# EAGLE design Bike02 (EAGLE 9.5.2)
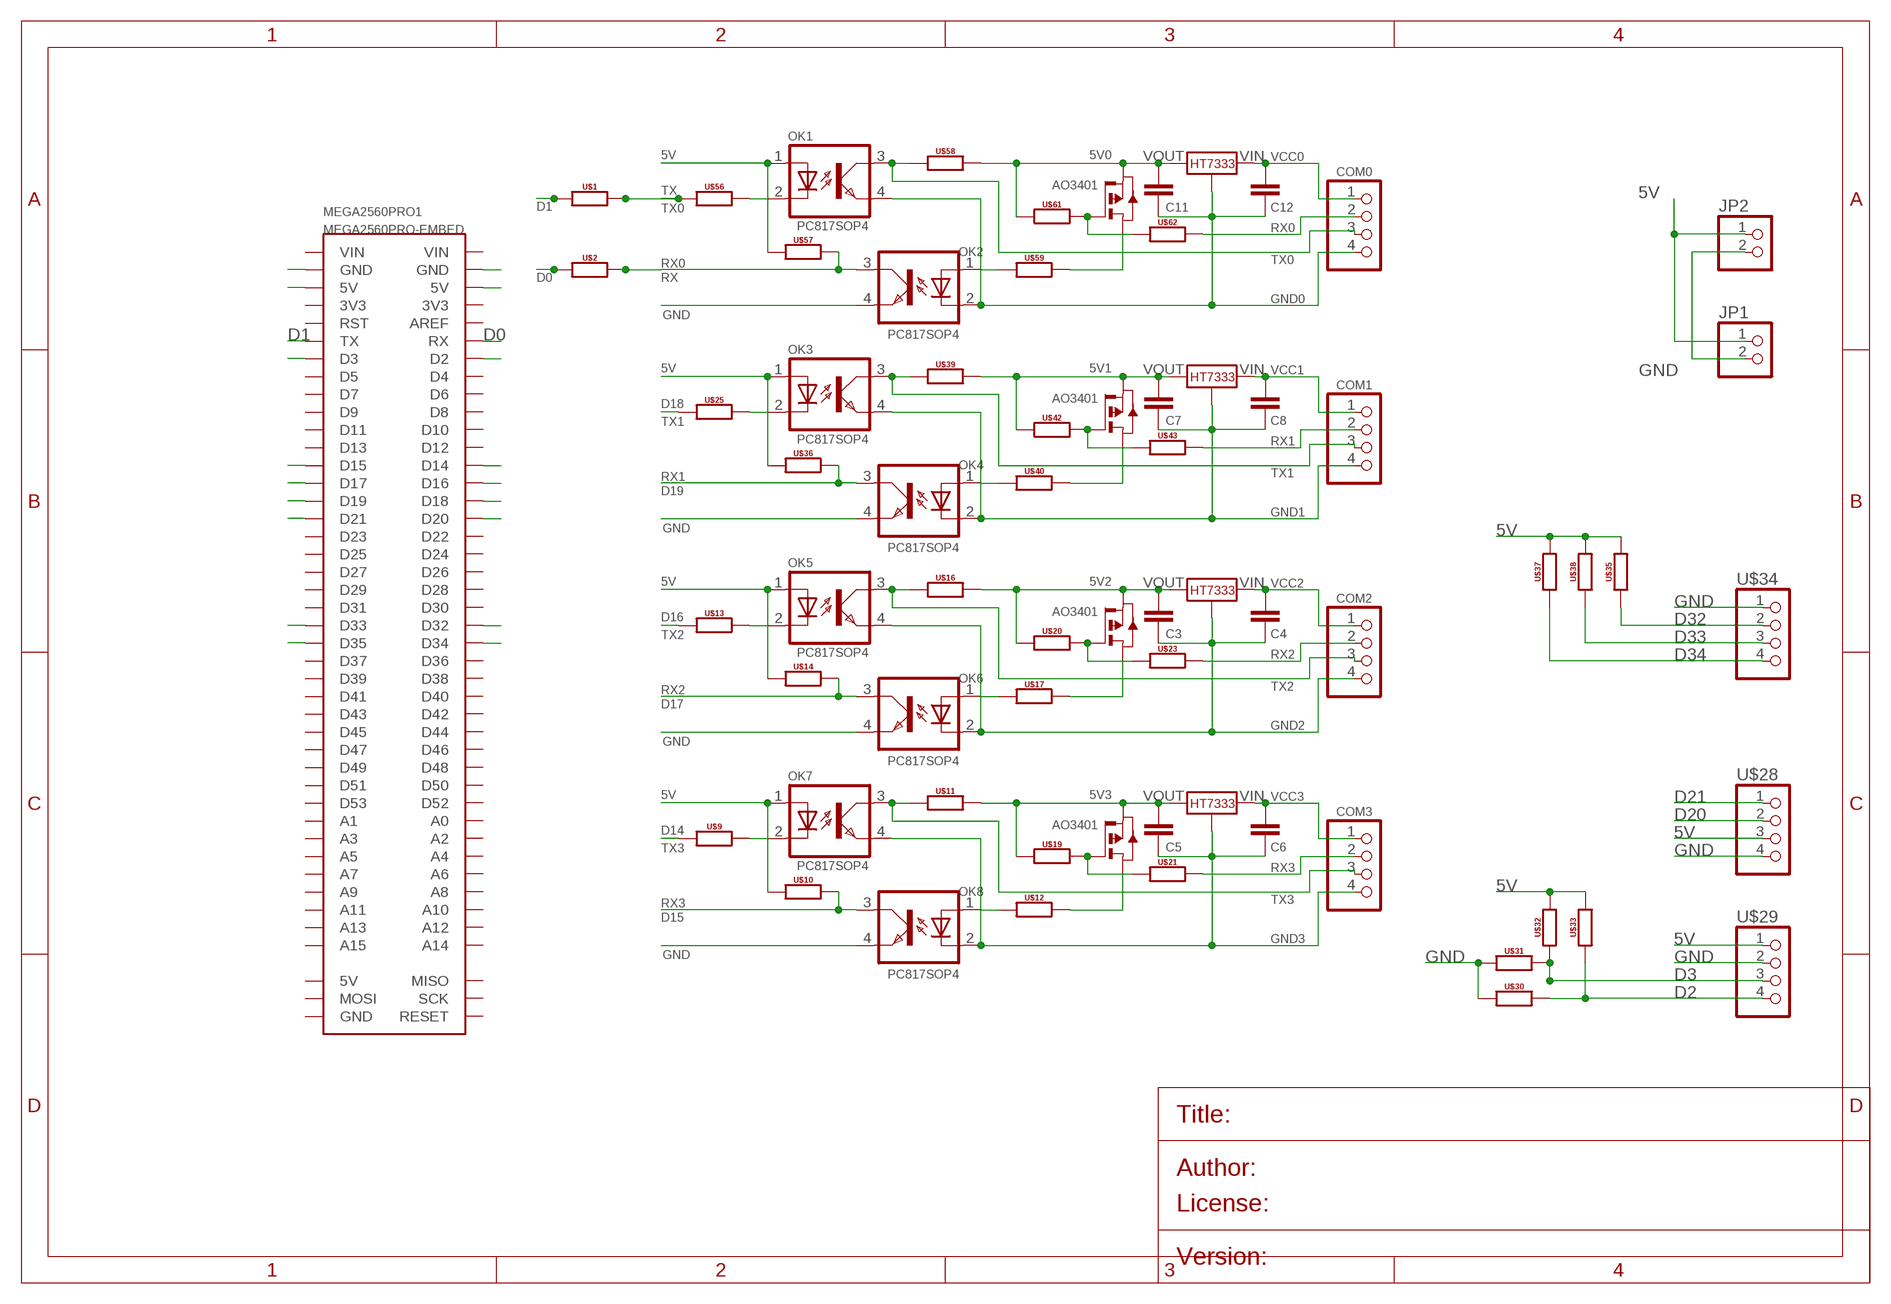
[diagram p0: schematic, sheet 1]

## Parts
C3  CAPACITOR0805  [0805]
C4  CAPACITOR0805  [0805]
C5  CAPACITOR0805  [0805]
C6  CAPACITOR0805  [0805]
C7  CAPACITOR0805  [0805]
C8  CAPACITOR0805  [0805]
C11  CAPACITOR0805  [0805]
C12  CAPACITOR0805  [0805]
COM0  PINHD-1X4_NO_SILK  [1X04_NO_SILK]
COM1  PINHD-1X4_NO_SILK  [1X04_NO_SILK]
COM2  PINHD-1X4_NO_SILK  [1X04_NO_SILK]
COM3  PINHD-1X4_NO_SILK  [1X04_NO_SILK]
JP1  PINHD-1X2-5_NO_SILK  [1X02-5_NO_SILK]
JP2  PINHD-1X2-5_NO_SILK  [1X02-5_NO_SILK]
MEGA2560PRO1  MEGA2560PRO-EMBED  [MEGA2560PRO-EMBED]
OK1  PC817SOP4  [SOP4-2.54]
OK2  PC817SOP4  [SOP4-2.54]
OK3  PC817SOP4  [SOP4-2.54]
OK4  PC817SOP4  [SOP4-2.54]
OK5  PC817SOP4  [SOP4-2.54]
OK6  PC817SOP4  [SOP4-2.54]
OK7  PC817SOP4  [SOP4-2.54]
OK8  PC817SOP4  [SOP4-2.54]
U$1  RESISTOR0805  [0805]
U$2  RESISTOR0805  [0805]
U$9  RESISTOR0805  [0805]
U$10  RESISTOR0805  [0805]
U$11  RESISTOR0805  [0805]
U$12  RESISTOR0805  [0805]
U$13  RESISTOR0805  [0805]
U$14  RESISTOR0805  [0805]
U$15  AO3401  [SOT23]
U$16  RESISTOR0805  [0805]
U$17  RESISTOR0805  [0805]
U$18  AO3401  [SOT23]
U$19  RESISTOR0805  [0805]
U$20  RESISTOR0805  [0805]
U$21  RESISTOR0805  [0805]
U$22  HT7333  [SOT89]
U$23  RESISTOR0805  [0805]
U$24  HT7333  [SOT89]
U$25  RESISTOR0805  [0805]
U$28  PINHD-1X4_NO_SILK  [1X04_NO_SILK]
U$29  PINHD-1X4_NO_SILK  [1X04_NO_SILK]
U$30  RESISTOR0805  [0805]
U$31  RESISTOR0805  [0805]
U$32  RESISTOR0805  [0805]
U$33  RESISTOR0805  [0805]
U$34  PINHD-1X4_NO_SILK  [1X04_NO_SILK]
U$35  RESISTOR0805  [0805]
U$36  RESISTOR0805  [0805]
U$37  RESISTOR0805  [0805]
U$38  RESISTOR0805  [0805]
U$39  RESISTOR0805  [0805]
U$40  RESISTOR0805  [0805]
U$41  AO3401  [SOT23]
U$42  RESISTOR0805  [0805]
U$43  RESISTOR0805  [0805]
U$44  HT7333  [SOT89]
U$56  RESISTOR0805  [0805]
U$57  RESISTOR0805  [0805]
U$58  RESISTOR0805  [0805]
U$59  RESISTOR0805  [0805]
U$60  AO3401  [SOT23]
U$61  RESISTOR0805  [0805]
U$62  RESISTOR0805  [0805]
U$63  HT7333  [SOT89]

## Nets
5V [PWR]: JP1.1 JP2.1 MEGA2560PRO1.5V@1(5V) MEGA2560PRO1.5V@2(5V) OK1.1(A) OK3.1(A) OK5.1(A) OK7.1(A) U$10.1 U$14.1 U$28.3 U$29.1 U$32.2 U$33.2 U$35.2 U$36.1 U$37.2 U$38.2 U$57.1
5V0 [PWR]: C11.1 U$58.2 U$60.2(S) U$61.1 U$63.VOUT
5V1 [PWR]: C7.1 U$39.2 U$41.2(S) U$42.1 U$44.VOUT
5V2 [PWR]: C3.1 U$16.2 U$18.2(S) U$20.1 U$24.VOUT
5V3 [PWR]: C5.1 U$11.2 U$15.2(S) U$19.1 U$22.VOUT
D0: MEGA2560PRO1.RX U$2.1
D1: MEGA2560PRO1.TX U$1.1
D2: MEGA2560PRO1.D2 U$29.4 U$30.2 U$33.1
D3: MEGA2560PRO1.D3 U$29.3 U$31.2 U$32.1
D14: MEGA2560PRO1.D14 U$9.1
D15: MEGA2560PRO1.D15 OK8.3(COL) U$10.2
D16: MEGA2560PRO1.D16 U$13.1
D17: MEGA2560PRO1.D17 OK6.3(COL) U$14.2
D18: MEGA2560PRO1.D18 U$25.1
D19: MEGA2560PRO1.D19 OK4.3(COL) U$36.2
D20: MEGA2560PRO1.D20 U$28.2
D21: MEGA2560PRO1.D21 U$28.1
D32: MEGA2560PRO1.D32 U$34.2 U$35.1
D33: MEGA2560PRO1.D33 U$34.3 U$38.1
D34: MEGA2560PRO1.D34 U$34.4 U$37.1
D35: MEGA2560PRO1.D35
GND [PWR]: JP1.2 JP2.2 MEGA2560PRO1.GND@1(GND) MEGA2560PRO1.GND@2(GND) OK2.4(EMIT) OK4.4(EMIT) OK6.4(EMIT) OK8.4(EMIT) U$28.4 U$29.2 U$30.1 U$31.1 U$34.1
GND0 [PWR]: C11.2 C12.2 COM0.4 OK1.4(EMIT) OK2.2(C) U$63.GND
GND1 [PWR]: C7.2 C8.2 COM1.4 OK3.4(EMIT) OK4.2(C) U$44.GND
GND2 [PWR]: C3.2 C4.2 COM2.4 OK5.4(EMIT) OK6.2(C) U$24.GND
GND3 [PWR]: C5.2 C6.2 COM3.4 OK7.4(EMIT) OK8.2(C) U$22.GND
N$5: OK7.2(C) U$9.2
N$6: OK5.2(C) U$13.2
N$7: OK6.1(A) U$17.1
N$8: OK8.1(A) U$12.1
N$9: U$12.2 U$15.3(D)
N$10: U$17.2 U$18.3(D)
N$11: U$18.1(G) U$20.2 U$23.1
N$12: U$15.1(G) U$19.2 U$21.1
N$13: OK3.2(C) U$25.2
N$14: OK4.1(A) U$40.1
N$15: U$40.2 U$41.3(D)
N$16: U$41.1(G) U$42.2 U$43.1
N$21: OK1.2(C) U$56.2
N$22: OK2.1(A) U$59.1
N$23: U$59.2 U$60.3(D)
N$24: U$60.1(G) U$61.2 U$62.1
RX: OK2.3(COL) U$2.2 U$57.2
RX0: COM0.2 U$62.2
RX1: COM1.2 U$43.2
RX2: COM2.2 U$23.2
RX3: COM3.2 U$21.2
TX: U$1.2 U$56.1
TX0: COM0.3 OK1.3(COL) U$58.1
TX1: COM1.3 OK3.3(COL) U$39.1
TX2: COM2.3 OK5.3(COL) U$16.1
TX3: COM3.3 OK7.3(COL) U$11.1
VCC0 [PWR]: C12.1 COM0.1 U$63.VIN
VCC1 [PWR]: C8.1 COM1.1 U$44.VIN
VCC2 [PWR]: C4.1 COM2.1 U$24.VIN
VCC3 [PWR]: C6.1 COM3.1 U$22.VIN
Unconnected: MEGA2560PRO1.3V3@1(3V3) MEGA2560PRO1.3V3@2(3V3) MEGA2560PRO1.5V@3(5V) MEGA2560PRO1.A0 MEGA2560PRO1.A1 MEGA2560PRO1.A2 MEGA2560PRO1.A3 MEGA2560PRO1.A4 MEGA2560PRO1.A5 MEGA2560PRO1.A6 MEGA2560PRO1.A7 MEGA2560PRO1.A8 MEGA2560PRO1.A9 MEGA2560PRO1.A10 MEGA2560PRO1.A11 MEGA2560PRO1.A12 MEGA2560PRO1.A13 MEGA2560PRO1.A14 MEGA2560PRO1.A15 MEGA2560PRO1.AREF MEGA2560PRO1.D4 MEGA2560PRO1.D5 MEGA2560PRO1.D6 MEGA2560PRO1.D7 MEGA2560PRO1.D8 MEGA2560PRO1.D9 MEGA2560PRO1.D10 MEGA2560PRO1.D11 MEGA2560PRO1.D12 MEGA2560PRO1.D13 MEGA2560PRO1.D22 MEGA2560PRO1.D23 MEGA2560PRO1.D24 MEGA2560PRO1.D25 MEGA2560PRO1.D26 MEGA2560PRO1.D27 MEGA2560PRO1.D28 MEGA2560PRO1.D29 MEGA2560PRO1.D30 MEGA2560PRO1.D31 MEGA2560PRO1.D36 MEGA2560PRO1.D37 MEGA2560PRO1.D38 MEGA2560PRO1.D39 MEGA2560PRO1.D40 MEGA2560PRO1.D41 MEGA2560PRO1.D42 MEGA2560PRO1.D43 MEGA2560PRO1.D44 MEGA2560PRO1.D45 MEGA2560PRO1.D46 MEGA2560PRO1.D47 MEGA2560PRO1.D48 MEGA2560PRO1.D49 MEGA2560PRO1.D50 MEGA2560PRO1.D51 MEGA2560PRO1.D52 MEGA2560PRO1.D53 MEGA2560PRO1.GND@3(GND) MEGA2560PRO1.MISO MEGA2560PRO1.MOSI MEGA2560PRO1.RESET MEGA2560PRO1.RST MEGA2560PRO1.SCK MEGA2560PRO1.VIN@1(VIN) MEGA2560PRO1.VIN@2(VIN)

## Notes on the sheet
- TX0
- RX0
- TX1
- RX1
- TX2
- RX2
- TX3
- RX3

## Library data of the parts
C3-C8 C11 C12 = flash_pow3:CAPACITOR: CAPACITOR, European symbol
COM0 COM1-COM3 U$28 U$29 U$34 = flash_pow3:PINHD-1X4
JP1 JP2 = flash_pow3:PINHD-1X2: PIN HEADER
MEGA2560PRO1 = flash_pow3:MEGA2560PRO-EMBED: Robotdyn Robotdyn Mega 2560 PRO (Embed) https://robotdyn.com/mega-2560-pro-embed-ch340g-atmega2560-16au.html
OK1-OK8 = flash_pow3:PC817: SHARP OPTO COUPLER
U$1 U$2 U$9-U$14 U$16 U$17 U$19-U$21 U$23 U$25 U$30-U$33 U$35-U$40 U$42 U$43 U$56-U$59 U$61 U$62 = flash_pow3:RESISTOR: Generic EU resistor symbol
U$15 U$18 U$41 U$60 = flash_pow3:AO3401; AVAILABILITY: Unavailable; DESCRIPTION: P-Channel 30V 4A _Ta_ 1.4W _Ta_ Surface Mount SOT-23-3; MF: Alpha & Omega Semiconductor; MP: AO3401; PACKAGE: None; PRICE: None
U$22 U$24 U$44 U$63 = flash_pow3:HT7333

## Net classes
1 PWR: width 0.3 mm

## Board
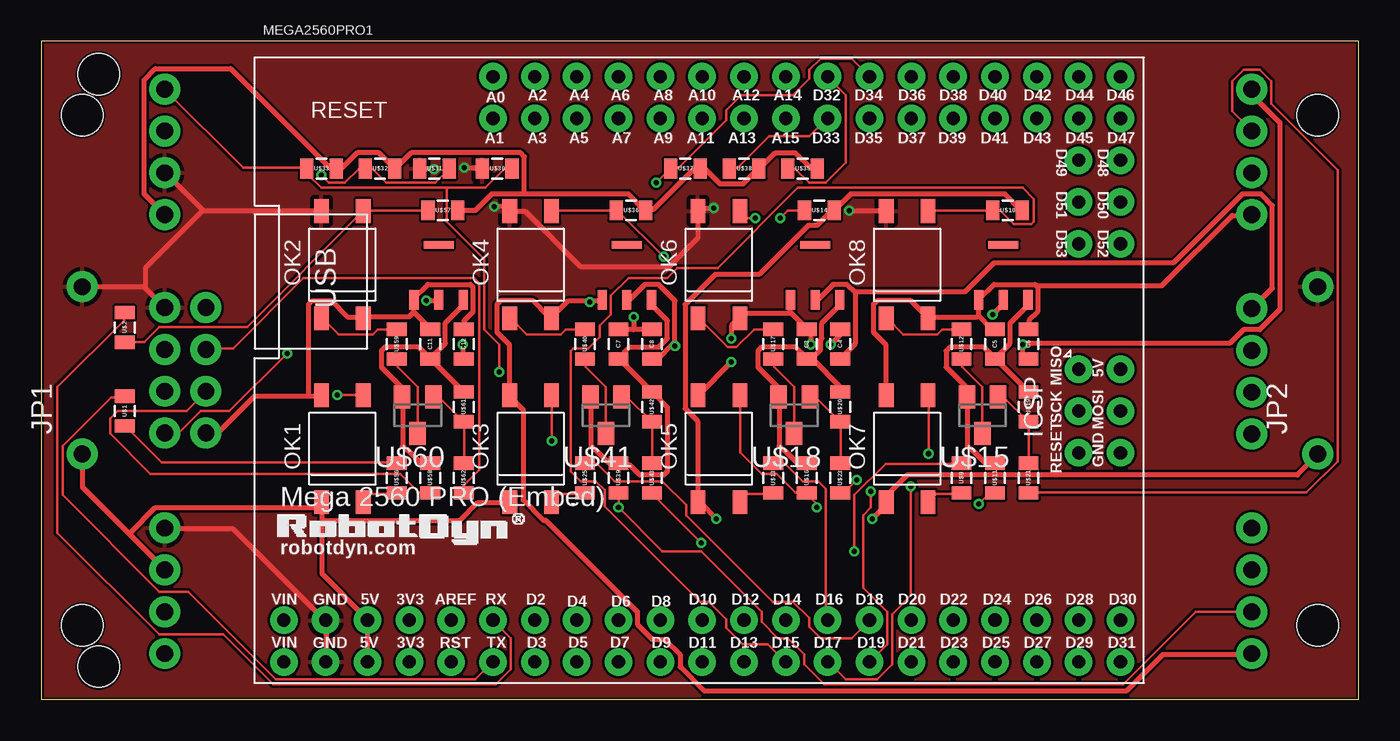
[diagram p1: board, top side]
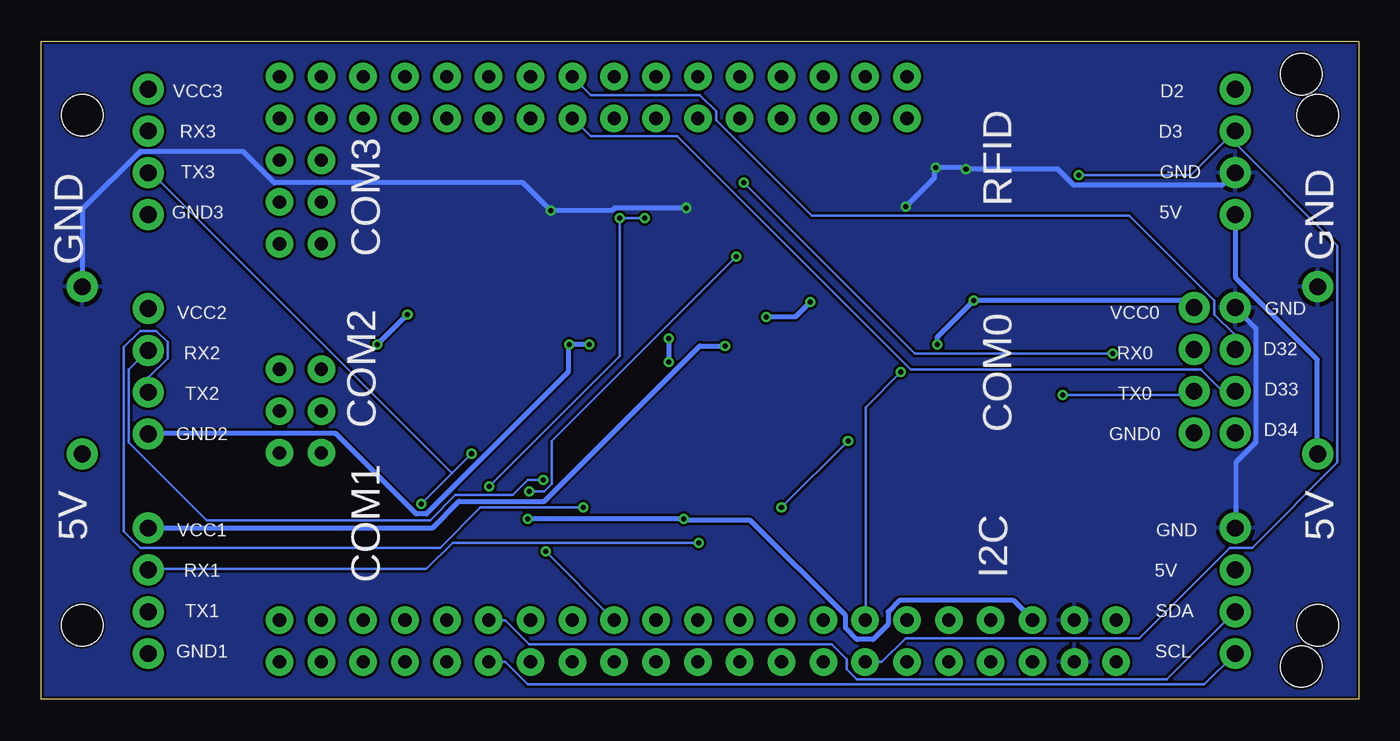
[diagram p2: board, bottom side, seen from below]

Size 80 x 40 mm. Coordinates in mm from the lower left corner, seen from the top.
Outline: 0,0 80,0 80,40 0,40 0,0
Copper layers (1*16): Top 0.035mm / dielectric 1.5mm / Bottom 0.035mm
Design rules "flash_boards.v281218": minimum track width 6mil, minimum drill 12mil, track to track 6mil, track to pad 6mil, pad to pad 6mil, via to via 6mil, smd to smd 0mil, copper to edge 6mil, drill to drill 6mil, minimum pad ring 10mil, minimum via ring 6mil, stop-mask expansion 2mil, vias tented up to drill 25mil, thermal gap 10mil
Holes 2.5 mm at 2.5,4.5 2.5,35.5 77.5,35.5 77.5,4.5 3.5,38 3.5,2

### Footprints (pad centres in the part's own frame; a part is rotated, then mirrored left to right if it is on the bottom)
0805 = smd 0.8 x 1.2: 1 -0.9,0; 2 0.9,0
1X04_NO_SILK = drill 1.016 pad 1.88: 1 -3.81,0; 2 -1.27,0; 3 1.27,0; 4 3.81,0
1X02-5_NO_SILK = drill 1.016 pad 1.88: 1 -5.08,0; 2 5.08,0
MEGA2560PRO-EMBED = drill 0.8 pad 1.676: 3V3@1 -25.4,-19.05; 3V3@2 -25.4,-16.51; 5V@1 -27.94,-19.05; 5V@2 -27.94,-16.51; 5V@3 17.78,-1.27; A0 -20.32,16.51; A1 -20.32,13.97; A2 -17.78,16.51; A3 -17.78,13.97; A4 -15.24,16.51; A5 -15.24,13.97; A6 -12.7,16.51; A7 -12.7,13.97; A8 -10.16,16.51; A9 -10.16,13.97; A10 -7.62,16.51; A11 -7.62,13.97; A12 -5.08,16.51; A13 -5.08,13.97; A14 -2.54,16.51; A15 -2.54,13.97; AREF -22.86,-16.51; D2 -17.78,-16.51; D3 -17.78,-19.05; D4 -15.24,-16.51; D5 -15.24,-19.05; D6 -12.7,-16.51; D7 -12.7,-19.05; D8 -10.16,-16.51; D9 -10.16,-19.05; D10 -7.62,-16.51; D11 -7.62,-19.05; D12 -5.08,-16.51; D13 -5.08,-19.05; D14 -2.54,-16.51; D15 -2.54,-19.05; D16 0,-16.51; D17 0,-19.05; D18 2.54,-16.51; D19 2.54,-19.05; D20 5.08,-16.51; D21 5.08,-19.05; D22 7.62,-16.51; D23 7.62,-19.05; D24 10.16,-16.51; D25 10.16,-19.05; D26 12.7,-16.51; D27 12.7,-19.05; D28 15.24,-16.51; D29 15.24,-19.05; D30 17.78,-16.51; D31 17.78,-19.05; D32 0,16.51; D33 0,13.97; D34 2.54,16.51; D35 2.54,13.97; D36 5.08,16.51; D37 5.08,13.97; D38 7.62,16.51; D39 7.62,13.97; D40 10.16,16.51; D41 10.16,13.97; D42 12.7,16.51; D43 12.7,13.97; D44 15.24,16.51; D45 15.24,13.97; D46 17.78,16.51; D47 17.78,13.97; D48 17.78,11.43; D49 15.24,11.43; D50 17.78,8.89; D51 15.24,8.89; D52 17.78,6.35; D53 15.24,6.35; GND@1 -30.48,-19.05; GND@2 -30.48,-16.51; GND@3 17.78,-6.35; MISO 15.24,-1.27; MOSI 17.78,-3.81; RESET 15.24,-6.35; RST -22.86,-19.05; RX -20.32,-16.51; SCK 15.24,-3.81; TX -20.32,-19.05; VIN@1 -33.02,-19.05; VIN@2 -33.02,-16.51
SOP4-2.54 = smd 0.889 x 1.448: 1 -1.27,-3.25; 2 1.27,-3.25; 3 1.27,3.25; 4 -1.27,3.25
SOT23 = smd 1 x 1.4: 1 -0.95,-1.1; 2 0.95,-1.1; 3 0,1.1
SOT89 = smd 0.559 x 1.194: GND -1.499,-0.597; VIN 0,-0.597; VOUT 1.499,-0.597 | smd 1.829 x 0.457: P$4 0,2.743

### Placement (x,y rotation side)
C3  46.48,21.59 90 top
C4  48.51,21.59 90 top
C5  57.91,21.59 90 top
C6  59.94,21.59 90 top
C7  35.05,21.59 90 top
C8  37.08,21.59 90 top
C11  23.62,21.59 90 top
C12  25.65,21.59 90 top
COM0  10,20 270 top
COM1  73.5,6.6 270 top
COM2  73.5,19.94 270 top
COM3  73.5,33.27 270 top
JP1  2.5,20 90 top
JP2  77.5,20 90 top
MEGA2560PRO1  47.75,21.34 0 top
OK1  18.29,15.24 0 top
OK2  18.29,26.42 0 top
OK3  29.72,15.24 0 top
OK4  29.72,26.42 0 top
OK5  41.15,15.24 0 top
OK6  41.15,26.42 0 top
OK7  52.58,15.24 0 top
OK8  52.58,26.42 0 top
U$1  5.08,17.53 270 top
U$2  5.08,22.61 270 top
U$9  55.88,13.46 270 top
U$10  58.67,29.72 180 top
U$11  57.91,13.46 90 top
U$12  55.88,21.59 270 top
U$13  44.45,13.46 270 top
U$14  47.24,29.72 180 top
U$15  57.15,17.27 180 top
U$16  46.48,13.46 90 top
U$17  44.45,21.59 270 top
U$18  45.72,17.27 180 top
U$19  59.94,17.78 270 top
U$20  48.51,17.78 270 top
U$21  59.94,13.46 270 top
U$22  58.42,24.89 0 top
U$23  48.51,13.46 270 top
U$24  46.99,24.89 0 top
U$25  33.02,13.46 270 top
U$28  7.5,6.6 90 top
U$29  7.5,33.27 90 top
U$30  27.69,32.26 0 top
U$31  23.88,32.26 0 top
U$32  20.57,32.26 0 top
U$33  17.02,32.26 0 top
U$34  7.5,20 270 top
U$35  46.23,32.26 0 top
U$36  35.81,29.72 180 top
U$37  39.12,32.26 0 top
U$38  42.67,32.26 0 top
U$39  35.05,13.46 90 top
U$40  33.02,21.59 270 top
U$41  34.29,17.27 180 top
U$42  37.08,17.78 270 top
U$43  37.08,13.46 270 top
U$44  35.56,24.89 0 top
U$56  21.59,13.46 270 top
U$57  24.38,29.72 180 top
U$58  23.62,13.46 90 top
U$59  21.59,21.59 270 top
U$60  22.86,17.27 180 top
U$61  25.65,17.78 270 top
U$62  25.65,13.46 270 top
U$63  24.13,24.89 0 top

### Tracks (layer width: path | path; a pad name or v marks a point on that pad's centre or on a via)
5V  (via drill 0.3)
  Top 0.3: JP2.1 77.5,14.86 76.28,13.64 52.58,13.64 51.36,12.42 51.36,12.04 OK7.1 51.21,11.89 51.21,11.73 v50.44,10.97 | U$10.1 59.51,29.72 58.52,30.71 49.15,30.71 48.16,29.72 U$14.1 48.01,29.72 47.09,28.8 46.56,28.8 43.59,25.83 40.92,25.83 39.09,24 39.09,17.68 39.85,16.92 39.85,12.04 OK5.1 40.01,11.96 v41,10.97 | U$35.2 47.09,32.31 46.71,32.31 45.8,33.22 44.58,33.22 43.66,32.31 U$38.2 43.51,32.23 42.6,31.32 41.22,31.32 40.31,32.23 40.08,32.23 U$37.2 39.93,32.16 39.55,32.16 37.19,29.79 36.8,29.79 U$36.1 36.65,29.72 35.66,30.71 29.34,30.71 | 29.34,30.71 27.36,30.71 26.36,29.72 25.3,29.72 U$57.1 | 29.34,30.71 29.34,30.79 29.34,32.99 29.11,33.22 22.48,33.22 21.57,32.31 U$32.2 21.41,32.31 20.5,33.22 19.2,33.22 18.29,32.31 17.98,32.31 U$33.2 17.83,32.31 17.53,32.31 11.51,38.33 6.93,38.33 6.25,37.64 6.25,30.71 7.47,29.49 U$29.1 | 17.07,10.9 17.07,7.62 19.81,4.88 MEGA2560PRO1.5V@2 19.81,4.72 MEGA2560PRO1.5V@1 | 17.07,10.9 17.07,11.96 OK1.1 16.99,11.66 6.93,11.66 5.41,10.13 5.33,10.06 | OK3.1 28.42,11.96 26.52,11.96 25.45,10.9 17.14,10.9 17.07,10.9 | 5.33,10.06 7.47,7.92 U$28.3 | 5.33,10.06 2.52,12.88 2.52,14.86 JP1.1
  Bottom 0.3: v50.44,10.97 v41,10.97 40.92,10.9 36.96,10.9 31.17,5.11 31.17,4.34 30.48,3.66 29.49,3.66 28.57,4.57 28.57,5.33 27.89,6.02 20.95,6.02 19.81,4.88 MEGA2560PRO1.5V@2 | U$29.1 7.47,29.41 7.47,25.6 2.52,20.65 2.52,14.94 JP1.1
5V0
  Top 0.3: U$58.2 23.62,14.4 23.01,14.4 22.25,15.16 22.17,15.16 21.95,15.39 21.95,18.36 U$60.2 21.87,18.52 21.87,18.97 20.65,20.19 20.65,21.18 20.88,21.41 22.94,21.41 23.55,20.8 C11.1 | U$63.VOUT 25.6,24.23 25.6,23.93 24.54,22.86 24.54,21.64 23.62,20.73 C11.1 | U$61.1 25.6,18.75 23.7,20.65 C11.1
5V1
  Top 0.3: U$41.2 33.38,18.36 33.38,15.39 33.6,15.16 33.68,15.16 34.44,14.4 35.05,14.4 U$39.2 35.13,14.25 35.74,14.25 36.35,13.64 37.8,13.64 38.02,13.87 38.02,17.75 37.19,18.59 U$42.1 37.03,18.75 35.13,20.65 C7.1 35.05,20.73 35.74,21.41 37.49,21.41 38.02,21.95 38.02,23.01 37.11,23.93 37.11,24.23 U$44.VOUT
5V2
  Top 0.3: U$16.2 46.48,14.4 45.87,14.4 45.11,15.16 45.03,15.16 44.81,15.39 44.81,18.36 U$18.2 44.73,18.52 44.73,18.97 43.51,20.19 43.51,21.18 43.74,21.41 45.8,21.41 46.41,20.8 C3.1 | U$24.VOUT 48.46,24.23 48.46,23.93 47.4,22.86 47.4,21.95 47.32,21.87 47.32,21.26 46.79,20.73 46.48,20.73 C3.1 | U$20.1 48.46,18.75 48.46,19.05 46.86,20.65 C3.1
5V3
  Top 0.3: U$11.2 57.91,14.4 57.3,14.4 56.54,15.16 56.46,15.16 56.24,15.39 56.24,18.36 U$15.2 56.16,18.52 56.16,18.97 54.94,20.19 54.94,21.18 55.17,21.41 57.23,21.41 57.84,20.8 C5.1 | U$22.VOUT 59.89,24.23 59.89,23.93 58.83,22.86 58.83,21.64 57.91,20.73 C5.1 | U$19.1 59.89,18.75 57.99,20.65 C5.1
D0
  Top 0.152: U$2.1 5.03,23.47 5.03,23.01 0.99,18.97 0.99,10.13 7.16,3.96 11.05,3.96 14.1,0.91 27.58,0.91 28.5,1.83 28.5,3.73 27.43,4.8 MEGA2560PRO1.RX
D1
  Top 0.152: MEGA2560PRO1.TX 26.36,1.22 14.25,1.22 8.91,6.55 7.16,6.55 1.29,12.42 1.29,15.39 4.27,18.36 5.03,18.36 U$1.1
D2  (via drill 0.3)
  Top 0.152: U$29.4 7.54,37.03 12.27,32.31 16.08,32.31 U$33.1 16.15,32.23 16.15,31.93 16.99,31.09 24.61,31.09 | 24.61,31.09 26.98,31.09 28.12,32.23 28.57,32.23 U$30.2 | v27.81,19.89 27.81,21.57 26.9,22.48 26.9,26.75 24.61,29.03 24.61,31.09
  Bottom 0.152: v27.81,19.89 29.95,17.75 29.95,4.88 MEGA2560PRO1.D2
D3  (via drill 0.3)
  Top 0.152: U$31.2 24.77,32.23 23.93,31.39 20.95,31.39 20.12,32.23 19.74,32.23 U$32.1 19.66,32.23 19.28,32.23 18.44,31.39 17.45,31.39 v16.99,31.85
  Bottom 0.152: v16.99,31.85 10.21,31.85 7.54,34.52 U$29.3 7.85,34.14 1.29,27.58 1.29,14.4 6.48,9.22 7.85,9.22 13.34,3.73 27.51,3.73 28.96,2.29 29.95,2.29 MEGA2560PRO1.D3
D14  (via drill 0.3)
  Top 0.152: v49.38,8.99 49.38,12.42 51.28,14.33 55.85,14.33 U$9.1
  Bottom 0.152: v49.38,8.99 45.26,4.88 MEGA2560PRO1.D14
D15
  Top 0.152: OK8.3 53.87,29.72 U$10.2 57.84,29.72 58.22,29.72 59.05,28.88 60.12,28.88 60.27,29.03 60.27,30.4 59.59,31.09 45.95,31.09 41.07,26.21 38.63,26.21 38.02,25.6 35.66,25.6 34.59,24.54 34.59,23.39 33.91,22.71 33.91,22.02 33.22,21.34 32.31,21.34 32.16,21.18 32.16,13.87 32.77,13.26 33.68,13.26 34.21,12.72 34.21,11.73 40.01,5.94 40.54,5.94 41.6,4.88 41.6,4.34 42.6,3.35 44.12,3.35 45.19,2.29 MEGA2560PRO1.D15
D16
  Top 0.152: U$13.1 44.5,14.33 45.19,14.33 46.25,13.26 47.17,13.26 47.62,12.8 47.62,4.95 47.7,4.88 MEGA2560PRO1.D16
D17  (via drill 0.3)
  Top 0.152: v44.88,29.26 45.34,29.72 U$14.2 | v43.36,29.26 42.82,29.26 42.44,29.64 OK6.3 | v52.81,12.95 52.81,6.33 51.66,5.18 51.66,2.13 50.75,1.22 48.84,1.22 47.78,2.29 MEGA2560PRO1.D17
  Bottom 0.152: v43.36,29.26 v44.88,29.26 44.88,20.88 v52.81,12.95
D18
  Top 0.152: U$25.1 33.07,14.33 33.76,14.33 34.82,13.26 37.72,13.26 39.17,11.81 39.17,11.2 44.42,5.94 45.64,5.94 46.63,4.95 46.63,4.42 47.32,3.73 49.23,3.73 50.29,4.8 MEGA2560PRO1.D18
D19  (via drill 0.3)
  Top 0.152: OK4.3 31.01,29.72 U$36.2 34.98,29.72 v37.8,26.9 | v50.37,12.65 50.37,11.66 49.91,11.2 49.91,6.78 51.36,5.33 51.36,3.35 MEGA2560PRO1.D19
  Bottom 0.152: v37.8,26.9 49,15.7 49,13.11 49.45,12.65 v50.37,12.65
D20
  Bottom 0.152: MEGA2560PRO1.D20 52.81,4.8 51.82,4.8 50.37,3.35 32,3.35 31.09,2.44 31.09,1.83 30.48,1.22 11.66,1.22 7.54,5.33 U$28.2
D21
  Bottom 0.152: MEGA2560PRO1.D21 52.81,2.29 51.82,2.29 50.44,0.91 9.37,0.91 7.54,2.74 U$28.1
D32
  Top 0.152: U$35.1 45.34,32.23 45.8,32.23 46.63,31.39 47.62,31.39 48.84,32.61 48.84,36.73 47.78,37.8 MEGA2560PRO1.D32
  Bottom 0.152: U$34.2 7.54,21.34 7.54,22.17 8.76,23.39 8.76,24.23 13.95,29.41 33.22,29.41 39.01,35.2 39.01,35.74 40.01,36.73 46.63,36.73 47.7,37.8 MEGA2560PRO1.D32
D33
  Top 0.152: U$38.1 41.83,32.31 42.29,32.31 44.2,34.21 46.63,34.21 47.7,35.28 MEGA2560PRO1.D33
  Bottom 0.152: U$34.3 7.54,18.75 8.31,18.75 9.6,20.04 27.2,20.04 41.38,34.21 46.63,34.21 47.7,35.28 MEGA2560PRO1.D33
D34  (via drill 0.3)
  Top 0.152: MEGA2560PRO1.D34 50.29,37.87 49.23,38.94 47.32,38.94 46.63,38.25 46.63,37.72 45.64,36.73 42.52,36.73 41.6,35.81 41.6,35.2 38.71,32.31 38.25,32.31 U$37.1 38.18,32.23 v37.34,31.39 | v14.94,21.03 11.43,17.53 9.68,17.53 8.38,16.23 7.54,16.23 U$34.4
  Bottom 0.152: v14.94,21.03 26.98,21.03 v37.34,31.39
GND  (via drill 0.3)
  Top 0.3: MEGA2560PRO1.GND@1 17.3,2.29 17.3,4.8 MEGA2560PRO1.GND@2 17.14,4.88 11.66,10.36 7.54,10.36 U$28.4 | 6.25,25.07 2.52,25.07 JP1.2 | 6.25,25.07 7.47,23.85 U$34.1 | v23.85,32.23 23.01,32.23 U$31.1 | v25.68,32.31 26.75,32.31 U$30.1 | 9.83,29.72 16.99,29.72 OK2.4 | 9.83,29.72 7.54,32 U$29.2 | 6.25,25.07 6.33,25.15 6.33,26.21 9.75,29.64 9.83,29.72 | v49.07,29.72 51.28,29.72 OK8.4 | v40.84,29.87 40.16,29.87 40.01,29.72 OK6.4 39.85,29.64 39.85,28.04 38.1,26.29 32.77,26.29 29.41,29.64 28.5,29.64 OK4.4 28.35,29.72 28.12,29.95 v27.51,29.95
  Bottom 0.3: U$29.2 7.54,32 8.31,31.24 17.3,31.24 18.29,32.23 v23.85,32.23 23.93,32.31 v25.68,32.31 25.76,32.23 25.76,31.7 v27.51,29.95 | U$28.4 7.47,10.44 7.47,14.4 6.25,15.62 6.25,22.55 7.47,23.77 U$34.1 | v40.84,29.87 45.19,29.87 45.34,29.72 v49.07,29.72 49.15,29.79 50.75,31.39 65.84,31.39 67.74,33.3 73.99,33.3 77.5,29.79 77.5,25.15 JP2.2
  pour Top: 80.01,40.13 -0.25,40.13 -0.25,0 -0.51,-0.25 80.01,-0.25
  pour Bottom: 79.76,40.13 -0.25,40.13 -0.25,0 79.76,0
GND0
  Top 0.3: 22.63,23.55 22.63,24.23 U$63.GND 22.63,24.38 23.47,25.22 26.06,25.22 26.21,25.07 26.21,23.55 25.68,23.01 25.68,22.55 C12.2 | 22.63,23.55 23.62,22.55 C11.2 | 22.63,23.55 22.55,23.47 22.33,23.24 19.58,23.24 OK2.2 19.43,23.24 18.59,23.24 17.6,24.23 16.46,24.23 16.23,24 16.23,18.52 16.23,18.44 | 16.23,18.44 12.95,18.44 10.74,16.23 10.06,16.23 COM0.4 | 16.23,18.44 16.99,18.44 OK1.4
GND1  (via drill 0.3)
  Top 0.3: 35.97,22.48 37.03,22.48 C8.2 | 35.97,22.48 35.05,22.48 C7.2 | 33.3,24.23 32,24.23 31.01,23.24 OK4.2 30.86,23.24 29.87,24.23 27.89,24.23 27.66,24 27.66,22.33 28.42,21.57 28.42,18.52 OK3.4 28.5,18.36 29.26,17.6 29.26,12.12 30.48,10.9 30.63,10.9 36.2,5.33 36.2,4.57 37.11,3.66 37.87,3.66 38.79,2.74 38.79,1.98 40.23,0.53 65.91,0.53 68.12,2.74 73.46,2.74 COM1.4 | 33.3,24.23 34.06,24.23 U$44.GND | v35.97,23.24 35.97,22.55 35.97,22.48 | v33.3,24.16 33.3,24.23
  Bottom 0.3: v35.97,23.24 34.21,23.24 v33.3,24.16
GND2  (via drill 0.3)
  Top 0.3: 45.49,23.55 45.49,24.23 U$24.GND | 45.49,23.55 46.48,22.55 C3.2 46.56,22.4 46.71,22.25 v46.71,21.57 | v47.93,21.57 48.46,22.1 48.46,22.48 C4.2 | v41.91,20.5 39.93,18.52 OK5.4 | v41.91,21.95 41.91,22.71 42.37,23.16 OK6.2 42.52,23.24 42.75,23.47 45.41,23.47 45.49,23.55
  Bottom 0.3: v46.71,21.57 v47.93,21.57 48.01,21.49 48.01,19.89 56.62,11.28 57.23,11.28 62.1,16.15 73.46,16.15 COM2.4 | v41.91,21.95 v41.91,20.5
GND3
  Top 0.3: 56.92,23.32 56.92,24.23 U$22.GND 57,24.38 57.84,25.22 60.35,25.22 60.5,25.07 | 56.92,23.32 57.68,22.55 57.91,22.55 C5.2 | 60.5,25.07 60.5,23.55 59.97,23.01 59.97,22.55 C6.2 | OK7.4 51.28,18.52 51.28,21.57 50.52,22.33 50.52,24 50.75,24.23 52.81,24.23 53.8,23.24 OK8.2 53.95,23.24 56.84,23.24 56.92,23.32 | COM3.4 73.46,29.41 72.31,29.41 68.05,25.15 60.58,25.15 60.5,25.07
N$5
  Top 0.152: U$9.2 55.85,12.5 54.33,12.5 53.87,12.04 OK7.2
N$6
  Top 0.152: U$13.2 44.42,12.5 42.9,12.5 42.44,12.04 OK5.2
N$7
  Top 0.152: U$17.1 44.42,22.48 43.28,22.48 42.22,21.41 41.68,21.41 39.93,23.16 OK6.1
N$8
  Top 0.152: U$12.1 55.85,22.48 54.71,22.48 54.41,22.17 52.35,22.17 51.36,23.16 OK8.1
N$9
  Top 0.152: U$12.2 55.93,20.65 55.93,20.19 57.15,18.97 57.15,16.23 U$15.3
N$10
  Top 0.152: U$17.2 44.5,20.65 44.5,20.19 45.72,18.97 45.72,16.23 U$18.3
N$11
  Top 0.152: U$23.1 48.54,14.4 48.54,16.84 U$20.2 48.46,16.92 47.02,18.36 46.71,18.36 U$18.1
N$12
  Top 0.152: U$21.1 59.97,14.4 59.97,16.84 U$19.2 59.89,16.92 58.45,18.36 58.14,18.36 U$15.1
N$13
  Top 0.152: U$25.2 32.99,12.5 31.47,12.5 31.01,12.04 OK3.2
N$14
  Top 0.152: U$40.1 32.99,22.48 31.85,22.48 31.55,22.17 29.49,22.17 28.5,23.16 OK4.1
N$15
  Top 0.152: U$40.2 33.07,20.65 33.07,20.19 34.29,18.97 34.29,16.23 U$41.3
N$16
  Top 0.152: U$43.1 37.11,14.4 37.11,16.84 U$42.2 37.03,16.92 35.59,18.36 35.28,18.36 U$41.1
N$21
  Top 0.152: U$56.2 21.57,12.5 20.04,12.5 19.58,12.04 OK1.2
N$22
  Top 0.152: U$59.1 21.57,22.48 20.42,22.48 20.12,22.17 18.06,22.17 17.07,23.16 OK2.1
N$23
  Top 0.152: U$59.2 21.64,20.65 21.64,20.19 22.86,18.97 22.86,16.23 U$60.3
N$24
  Top 0.152: U$62.1 25.68,14.4 25.68,16.84 U$61.2 25.6,16.92 24.16,18.36 23.85,18.36 U$60.1
RX
  Top 0.152: U$2.2 5.11,21.72 6.25,21.72 7.16,22.63 12.5,22.63 19.51,29.64 OK2.3 19.58,29.72 U$57.2
RX0
  Top 0.152: U$62.2 25.68,12.57 25.68,13.03 26.59,13.95 26.59,25.3 26.29,25.6 15.93,25.6 11.66,21.34 10.06,21.34 COM0.2
RX1  (via drill 0.3)
  Top 0.152: v40.08,9.53 37.11,12.5 U$43.2
  Bottom 0.152: v40.08,9.53 55.02,9.53 56.62,7.92 73.46,7.92 COM1.2
RX2  (via drill 0.3)
  Top 0.152: v49.53,13.34 48.77,12.57 48.54,12.57 U$23.2
  Bottom 0.152: v49.53,13.34 50.44,13.34 51.36,12.42 54.86,12.42 56.39,10.9 69.95,10.9 74.68,15.62 74.68,20.04 73.53,21.18 COM2.2
RX3
  Top 0.152: U$21.2 59.97,12.57 76.81,12.57 78.72,14.48 78.72,32.16 74.68,36.2 74.68,37.57 73.99,38.25 73,38.25 72.31,37.57 72.31,35.74 73.46,34.59 COM3.2
TX
  Top 0.152: U$56.1 21.57,14.4 7.32,14.4 5.11,16.61 U$1.2
TX0  (via drill 0.3)
  Top 0.152: U$58.1 23.62,12.57 22.94,12.57 21.79,13.72 6.63,13.72 4.19,16.15 4.19,17.07 4.65,17.53 8.84,17.53 9.98,18.67 COM0.3 | v17.98,18.52 19.51,18.52 OK1.3
  Bottom 0.152: v17.98,18.52 10.21,18.52 10.06,18.67 COM0.3
TX1  (via drill 0.3)
  Top 0.152: v31.01,15.7 31.01,18.44 OK3.3 | U$39.1 35.05,12.5 v35.05,11.66 37.72,8.99 40.08,8.99 43.74,5.33 43.74,4.72 44.73,3.73 45.34,3.73 46.33,2.74 46.33,2.13 47.55,0.91 65.68,0.91 70.1,5.33 73.46,5.33 COM1.3
  Bottom 0.152: v31.01,15.7 v35.05,11.66
TX2  (via drill 0.3)
  Top 0.152: OK5.3 42.44,18.44 42.44,15.01 43.74,13.72 44.65,13.72 45.8,12.57 46.48,12.57 U$16.1 46.48,12.5 47.09,11.89 v47.09,11.66
  Bottom 0.152: v47.09,11.66 53.34,11.66 55.78,9.22 73.99,9.22 74.98,10.21 74.98,21.41 73.99,22.4 73,22.4 72.31,21.72 72.31,20.73 73.46,19.58 73.46,18.67 COM2.3
TX3  (via drill 0.3)
  Top 0.152: v56.92,11.89 57.53,12.5 57.91,12.5 U$11.1 | v53.87,14.94 53.87,18.44 OK7.3
  Bottom 0.152: v53.87,14.94 55.05,13.75 | 55.05,13.75 v56.92,11.89 | COM3.3 73.46,32 73.3,32 55.09,13.79 55.05,13.75
VCC0  (via drill 0.3)
  Top 0.3: v23.39,24.23 24.08,24.23 U$63.VIN | v25.6,21.57 25.6,20.73 C12.1
  Bottom 0.3: COM0.1 10.06,23.85 10.44,24.23 v23.39,24.23 23.47,24.16 25.6,22.02 v25.6,21.57
VCC1  (via drill 0.3)
  Top 0.3: 38.33,21.57 37.49,20.73 37.11,20.73 C8.1 | 38.33,21.57 38.48,21.72 38.48,24.23 37.49,25.22 36.65,25.22 35.74,24.31 35.59,24.31 U$44.VIN | v38.48,21.49 38.41,21.49 38.33,21.57
  Bottom 0.3: v38.48,21.49 40.01,21.49 49.45,12.04 54.63,12.04 56.24,10.44 73.46,10.44 COM1.1
VCC2
  Top 0.3: 49.45,24.69 48.92,25.22 48.08,25.22 47.17,24.31 47.02,24.31 U$24.VIN | 49.45,24.69 49.45,21.64 48.54,20.73 C4.1 | 49.45,24.69 49.53,24.77 56.08,24.77 57.84,26.52 68.73,26.52 72.92,30.71 74.07,30.71 74.75,30.02 74.75,24.99 73.53,23.77 COM2.1
VCC3  (via drill 0.3)
  Top 0.3: v57.76,23.39 58.37,24 58.37,24.23 U$22.VIN | C6.1 59.89,20.73 59.59,21.03 v59.59,21.57 59.66,21.64 72.16,21.64 73,22.48 73.99,22.48 75.21,23.7 75.21,35.05 73.53,36.73 73.53,37.03 COM3.1
  Bottom 0.3: v59.59,21.57 v57.76,23.39

### Text on the board
_tNames: GND | GND | 5V | 5V
_bNames: D2 | VCC3 | D3 | RX3 | GND | TX3 | RFID | 5V | GND3 | GND | COM3 | GND | GND | VCC0 | VCC2 | D32 | RX0 | RX2 | D33 | TX0 | TX2 | COM2 | D34 | GND0 | COM0 | GND2 | 5V | GND | VCC1 | 5V | 5V | I2C | COM1 | RX1 | SDA | TX1 | SCL | GND1